# EAGLE design Breakout_UVA (EAGLE 9.6.2)
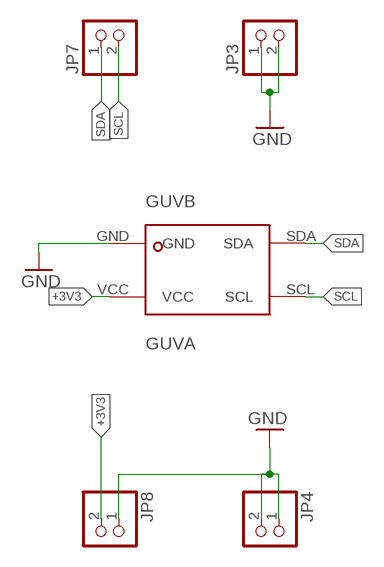
[diagram p0: schematic, sheet 1]

## Parts
GUVB  GUVA  GUVA-C32SM  [GUV_A/B]
JP3  PINHD-1X2  [1X02(PAD_REDUZIDO)]
JP4  PINHD-1X2  [1X02(PAD_REDUZIDO)]
JP7  PINHD-1X2  [1X02(PAD_REDUZIDO)]
JP8  PINHD-1X2  [1X02(PAD_REDUZIDO)]

## Nets
+3V3: GUVB.VCC JP8.2
GND: GUVB.GND JP3.1 JP3.2 JP4.1 JP4.2 JP8.1
SCL: GUVB.SCL JP7.2
SDA: GUVB.SDA JP7.1

## Library data of the parts
GUVB = GUVX:GUVA-C32SM
JP3 JP4 JP7 JP8 = pinhead(1x3):PINHD-1X2: PIN HEADER

## Board
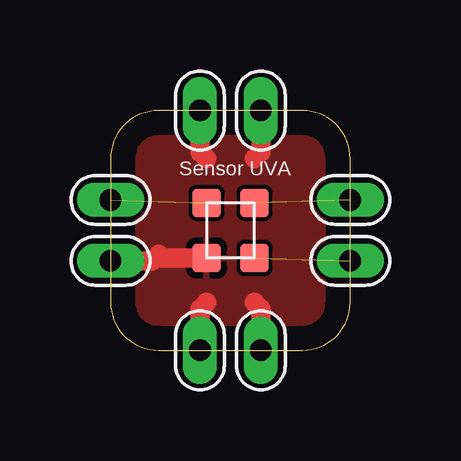
[diagram p1: board, top side]
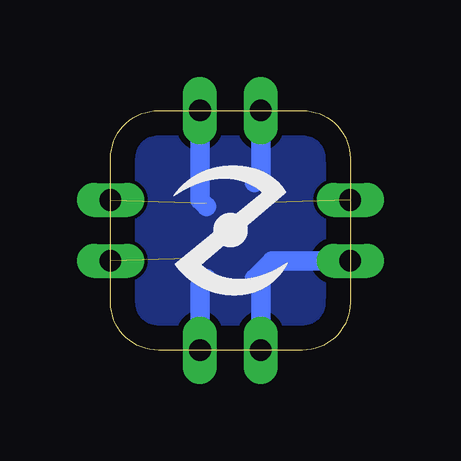
[diagram p2: board, bottom side, seen from below]

Size 10 x 10 mm. Coordinates in mm from the lower left corner, seen from the top.
Outline: 0,8 0,2 arc90 2,0 8,0 arc90 10,2 10,8 arc90 8,10 2,10 arc90 0,8
Copper layers (1*16): Top 0.035mm / dielectric 1.5mm / Bottom 0.035mm
Design rules "default": minimum track width 6mil, minimum drill 0.35mm, track to track 6mil, track to pad 6mil, pad to pad 6mil, via to via 6mil, smd to smd 6mil, copper to edge 40mil, drill to drill 6mil, minimum pad ring 10mil, minimum via ring 8mil, stop-mask expansion 4mil, vias tented up to drill 0mil, thermal gap 10mil

### Footprints (pad centres in the part's own frame; a part is rotated, then mirrored left to right if it is on the bottom)
GUV_A/B = smd 1.2 x 1.2: GND 1,1.15; SCL -1,-1.15; SDA -1,1.15; VCC 1,-1.15
1X02(PAD_REDUZIDO) = drill 0.9 pad 1.2 long: 1 -1.27,0; 2 1.27,0

### Placement (x,y rotation side)
GUVB  5,5 180 top
JP3  5,0 0 top
JP4  5,10 0 top
JP7  10,5 90 top
JP8  0,5 90 top

### Tracks (layer width: path | path; a pad name or v marks a point on that pad's centre or on a via)
+3V3  (1 unrouted)
GND
  Top 0.813: JP4.1 3.73,8.27 4,8 | JP4.2 6.27,8.27 6,8 | JP3.2 6.27,1.73 6,2 | JP3.1 3.73,1.73 4,2 | JP8.1 1.73,3.73 1.85,3.85 | 1.85,3.85 2,4 | GUVB.GND 1.85,3.85
  Bottom 0.813: JP4.1 3.73,7.27 4,7 | JP4.2 6.27,6.27 6,6 | JP3.2 6.27,2.73 6,3 | JP3.1 3.73,2.73 4,3 3.27,3.73 JP8.1
  pour Top: -1,11 -1,-1 11,-1 11,10 11,11
  pour Bottom: -1,11 -1,-1 11,-1 11,11
SCL  (1 unrouted)
SDA  (1 unrouted)

### Text on the board
tNames: Sensor UVA